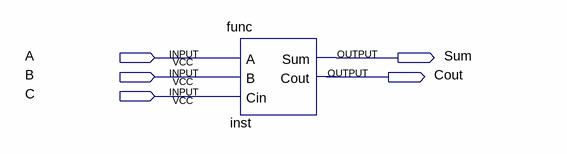
[diagram p0: schematic sheet]
// Quartus schematic bttl1.bdf as structural Verilog: 1 symbols, 5 pins
module bttl1 (
  input  A,
  input  B,
  input  C,
  output Sum,
  output Cout
);

  func inst (.A(A), .B(B), .Cin(C), .Sum(Sum), .Cout(Cout));
endmodule
